# Altium schematic sheet stm32c8t6.SchDoc
size A3
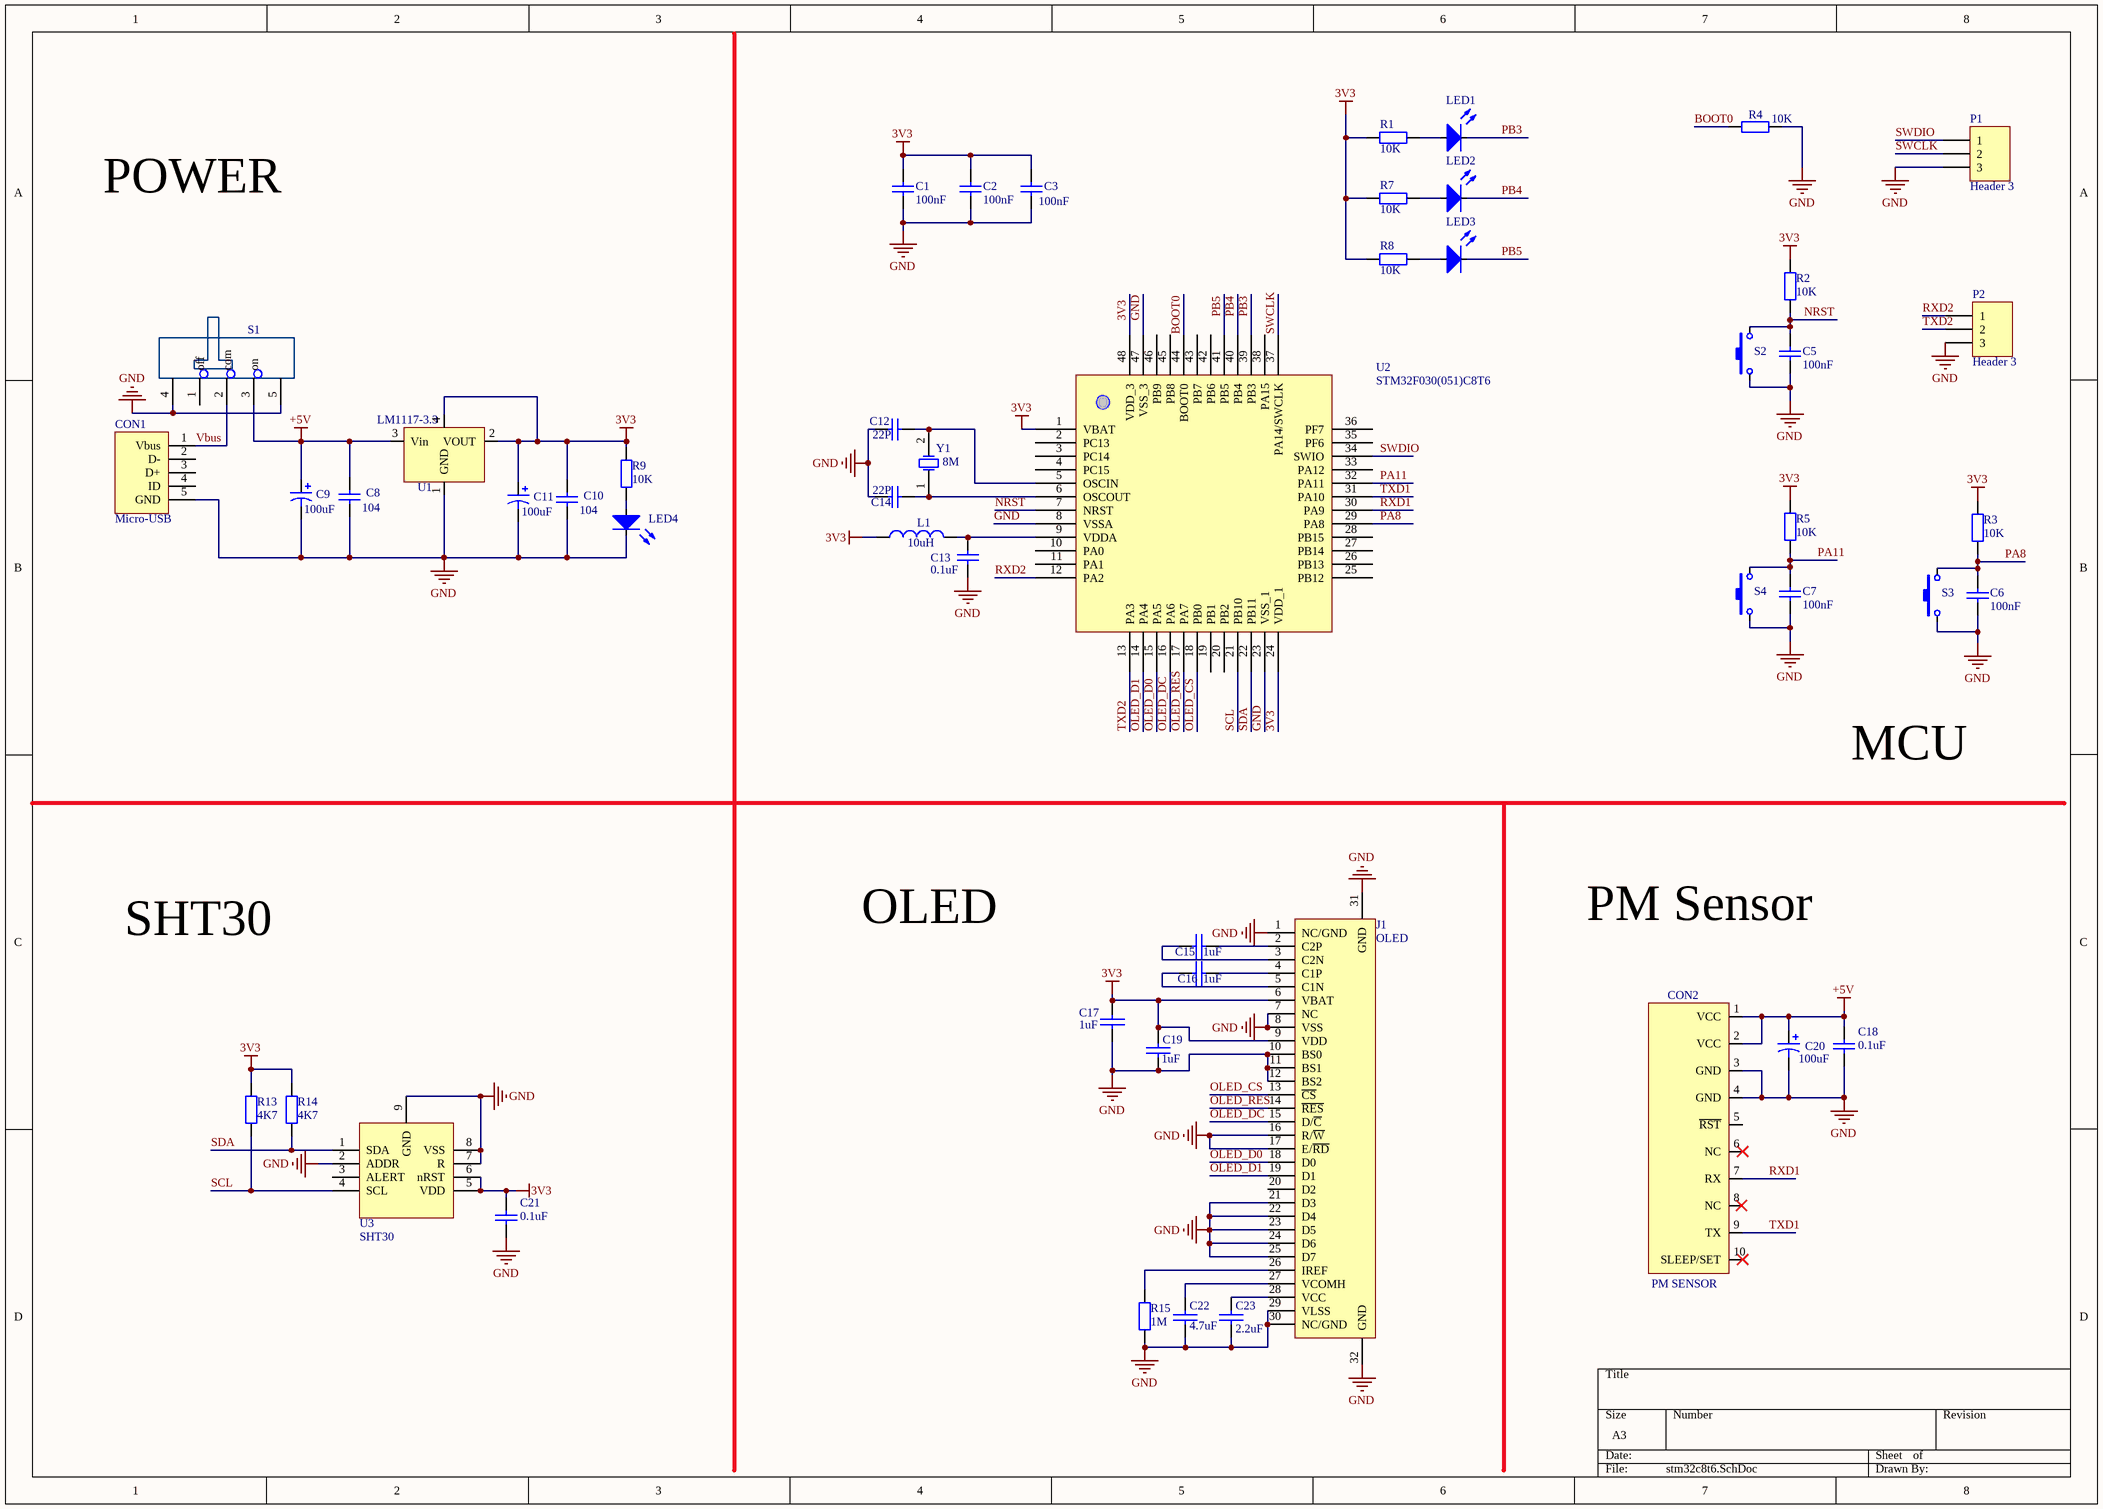
[diagram p0: stm32c8t6.SchDoc]

## Parts
C1  value 100nF  [0603BY]  (hidden comment: Cap)
C2  value 100nF  [0603BY]  (hidden comment: Cap)
C3  value 100nF  [0603BY]  (hidden comment: Cap)
C5  value 100nF  [0603BY]  (hidden comment: Cap)
C6  value 100nF  [0603BY]  (hidden comment: Cap)
C7  value 100nF  [0603BY]  (hidden comment: Cap)
C8  value 104  [0603BY]  (hidden comment: 100nF)
C9  value 100uF  [C T - TAJB]  (hidden comment: 100uF/35V)
C10  value 104  [0603BY]  (hidden comment: 100nF)
C11  value 100uF  [C T - TAJB]  (hidden comment: 100uF/35V)
C12  value 22P  [0603BY]  (hidden comment: Cap)
C13  value 0.1uF  [0603BY]  (hidden comment: 100nF)
C14  value 22P  [0603BY]  (hidden comment: Cap)
C15  1uF  [0603BY]
C16  1uF  [0603BY]
C17  1uF  [0603BY]
C18  value 0.1uF  [0603BY]  (hidden comment: 100nF)
C19  1uF  [0603BY]
C20  value 100uF  [C T - TAJB]  (hidden comment: 100uF/35V)
C21  value 0.1uF  [0603BY]  (hidden comment: 100nF)
C22  4.7uF  [0603BY]
C23  2.2uF  [0603BY]
CON1  Micro-USB  [HF00226SA - New]
CON2  PM SENSOR  [PM2.5]
J1  OLED  [FPC-30P]
L1  10uH  [0805 C]
LED1  (no value)  [b1206]
LED2  (no value)  [b1206]
LED3  (no value)  [b1206]
LED4  (no value)  [B-0603]
P1  Header 3  [HDR1X3]
P2  Header 3  [HDR1X3]
R1  value 10K  [0603BY]  (hidden comment: Res2)
R2  value 10K  [0603BY]  (hidden comment: Res2)
R3  value 10K  [0603BY]  (hidden comment: Res2)
R4  value 10K  [0603BY]  (hidden comment: Res2)
R5  value 10K  [0603BY]  (hidden comment: Res2)
R7  value 10K  [0603BY]  (hidden comment: Res2)
R8  value 10K  [0603BY]  (hidden comment: Res2)
R9  value 10K  [0603BY]  (hidden comment: Res2)
R13  value 4K7  [0603BY]  (hidden comment: Res2)
R14  value 4K7  [0603BY]  (hidden comment: Res2)
R15  value 1M  [0603BY]  (hidden comment: Res2)
S1  SW-SPST  [SS-12F44]  (value not drawn)
S2  SW-PB  [HQ1SA]  (value not drawn)
S3  SW-PB  [HQ1SA]  (value not drawn)
S4  SW-PB  [HQ1SA]  (value not drawn)
U1  LM1117-3.3  [SOT223]
U2  STM32F030(051)C8T6  [stm32f103_48]
U3  SHT30  [SHT30]
Y1  8M  [XTAL-DIP]

## Nets
3V3: C1.1 C2.1 C3.2 C10.1 C11.1 C17.2 C19.2 C21.2 J1.6(VBAT) J1.9(VDD) L1.2 R1.1 R2.2 R3.2 R5.2 R7.1 R8.1 R9.2 R13.2 R14.2 U1.2(VOUT) U1.4(VOUT) U2.1(VBAT) U2.24(VDD_1) U2.48(VDD_3) U3.5(VDD) U3.6(nRST)
+5V: C8.1 C9.1 C18.2 C20.1 CON2.1(VCC) CON2.2(VCC) S1.3(on) U1.3(Vin)
GND: C1.2 C2.2 C3.1 C5.2 C6.2 C7.2 C8.2 C9.2 C10.2 C11.2 C12.2 C13.1 C14.2 C17.1 C18.1 C19.1 C20.2 C21.1 C22.2 C23.2 CON1.5(GND) CON2.3(GND) CON2.4(GND) J1.1(NC/GND) J1.7(NC) J1.8(VSS) J1.10(BS0) J1.11(BS1) J1.12(BS2) J1.16(R/~{W}) J1.17(E/~{RD}) J1.21(D3) J1.22(D4) J1.23(D5) J1.24(D6) J1.25(D7) J1.29(VLSS) J1.30(NC/GND) J1.31(GND) J1.32(GND) LED4.2(K) P1.3 P2.3 R4.2 R15.1 S1.4 S1.5 S2.1 S3.1 S4.1 U1.1(GND) U2.8(VSSA) U2.23(VSS_1) U2.47(VSS_3) U3.2(ADDR) U3.7(R) U3.8(VSS) U3.9(GND)
BOOT0: R4.1 U2.44(BOOT0)
NRST: C5.1 R2.1 S2.2 U2.7(NRST)
OLED_CS: J1.13(~{CS}) U2.18(PB0)
OLED_D0: J1.18(D0) U2.15(PA5)
OLED_D1: J1.19(D1) U2.14(PA4)
OLED_DC: J1.15(D/~{C}) U2.16(PA6)
OLED_RES: J1.14(~{RES}) U2.17(PA7)
PA8: C6.1 R3.1 S3.2 U2.29(PA8)
PA11: C7.1 R5.1 S4.2 U2.32(PA11)
PB3: LED1.2(K) U2.39(PB3)
PB4: LED2.2(K) U2.40(PB4)
PB5: LED3.2(K) U2.41(PB5)
RXD1: CON2.7(RX) U2.30(PA9)
RXD2: P2.1 U2.12(PA2)
SCL: R13.1 U2.21(PB10) U3.4(SCL)
SDA: R14.1 U2.22(PB11) U3.1(SDA)
SWCLK: P1.2 U2.37(PA14/SWCLK)
SWDIO: P1.1 U2.34(SWIO)
TXD1: CON2.9(TX) U2.31(PA10)
TXD2: P2.2 U2.13(PA3)
Vbus: CON1.1(Vbus) S1.2(com)
NetC12_1: C12.1 U2.5(OSCIN) Y1.2(OSC2)
NetC13_2: C13.2 L1.1 U2.9(VDDA)
NetC14_1: C14.1 U2.6(OSCOUT) Y1.1(OSC1)
NetC15_1: C15.1 J1.3(C2N)
NetC15_2: C15.2 J1.2(C2P)
NetC16_1: C16.1 J1.5(C1N)
NetC16_2: C16.2 J1.4(C1P)
NetC22_1: C22.1 J1.27(VCOMH)
NetC23_1: C23.1 J1.28(VCC)
NetJ1_26: J1.26(IREF) R15.2
NetLED1_1: LED1.1(A) R1.2
NetLED2_1: LED2.1(A) R7.2
NetLED3_1: LED3.1(A) R8.2
NetLED4_1: LED4.1(A) R9.1

Not connected (* = marked no-connect by the designer): CON1 2(D-) 3(D+) 4(ID); CON2 5(~{RST}) 6(NC)* 8(NC) 10(SLEEP/SET)*; J1 20(D2); S1 1(off); U2 2(PC13) 3(PC14) 4(PC15) 10(PA0) 11(PA1) 19(PB1) 20(PB2) 25(PB12) 26(PB13) 27(PB14) 28(PB15) 33(PA12) 35(PF6) 36(PF7) 38(PA15) 42(PB6) 43(PB7) 45(PB8) 46(PB9); U3 3(ALERT)

## Notes on the sheet
- POWER
- MCU
- SHT30
- OLED
- PM Sensor

## Library data of the parts
C1-C3 C5-C8 C10 C12-C14 C18 C21 = Cap: Capacitor; Published: 8-Jun-2000; LatestRevisionDate: 17-Jul-2002; LatestRevisionNote: Re-released for DXP Platform.; PackageReference: RAD-0.3; Publisher: Altium Limited
C9 C11 C20 = Cap Pol1: Polarized Capacitor (Radial); Published: 8-Jun-2000; LatestRevisionDate: 17-Jul-2002; LatestRevisionNote: Re-released for DXP Platform.; PackageReference: RB7.6-15; Publisher: Altium Limited
C15-C17 C19 C22 C23 = CAP: Capacitor
J1 = OLED: FPC-0.5*30
L1 = Inductor: HL00079SA
LED1-LED4 = LED0: Typical INFRARED GaAs LED; Published: 8-Jun-2000; LatestRevisionDate: 08-Jul-2005; LatestRevisionNote: Mech Layer 1 removed.; PackageReference: LED-0; Publisher: Altium Limited
P1 P2 = Header 3: Header, 3-Pin; LatestRevisionDate: 17-Jul-2002; LatestRevisionNote: Re-released for DXP Platform.; Publisher: Altium Limited
R1-R5 R7-R9 R13-R15 = Res2: Resistor; Published: 8-Jun-2000; LatestRevisionDate: 17-Jul-2002; LatestRevisionNote: Re-released for DXP Platform.; PackageReference: AXIAL-0.4; Publisher: Altium Limited
S1 = SW-SPST: Single-Pole, Single-Throw Switch; Published: 24-Mar-1999; LatestRevisionDate: 17-Jul-2002; LatestRevisionNote: Re-released for DXP Platform.; PackageReference: SPST-2; Publisher: Altium Limited
S2-S4 = SW-PB: Switch; Published: 24-Mar-1999; LatestRevisionDate: 17-Jul-2002; LatestRevisionNote: Re-released for DXP Platform.; PackageReference: SPST-2; Publisher: Altium Limited
U1 = LM1117
U2 = STM32F030C8T6
Y1 = XTAL: Crystal Oscillator; Published: 8-Jun-2000; LatestRevisionDate: 17-Jul-2002; LatestRevisionNote: Re-released for DXP Platform.; PackageReference: R38; Publisher: Altium Limited